# Altium schematic sheet 比较器.SchDoc
size A4
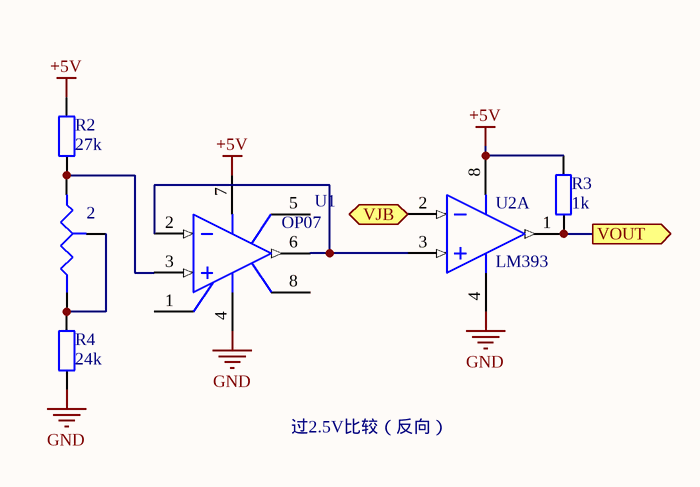
[diagram p0: 比较器.SchDoc]

## Parts
2  滑阻  [三脚滑阻]  (value not drawn)
R2  value 27k  [AXIAL-0.4]  (hidden comment: Res2)
R3  value 1k  [AXIAL-0.4]  (hidden comment: Res2)
R4  value 24k  [AXIAL-0.4]  (hidden comment: Res2)
U1  OP07  [N-8_A]
U2  LM393  [626-05]  (part A of 2)

## Ports
VJB (in), VOUT (out)

## Nets
+5V: R2.2 R3.2 U1.7(V+) U2.8(V+)
GND: R4.1 U1.4(V-) U2.4(GND)
VJB: U2.2(IN-) ; port VJB
VOUT: R3.1 U2.1(OUT) ; port VOUT
Net2_1: 2.1(A) R2.1 U1.3(IN+)
Net2_2: 2.2(TAP) 2.3(B) R4.2
NetU1_2: U1.2(IN-) U1.6(OUT) U2.3(IN+)

Not connected (* = marked no-connect by the designer): U1 1(NULL1) 5(NC) 8(NULL2)

## Notes on the sheet
- 过2.5V比较（反向）
- 标题
- 日期
- 红外数字模拟接收一体机
- 2015 5 29
- 作者
- 模电组
- 单位
- 电子技术协会

## Library data of the parts
R2-R4 = Res2: Resistor; Published: 8-Jun-2000; LatestRevisionDate: 17-Jul-2002; LatestRevisionNote: Re-released for DXP Platform.; PackageReference: AXIAL-0.4; Publisher: Altium Limited
U1 = ADOP07CN: Ultra-Low Offset Voltage Operational Amplifier; Note: Pin 5 is not connected.; Published: 8-Jun-2000; LatestRevisionDate: 04-Mar-2005; LatestRevisionNote: Stylized 3D Model Added.; DatasheetVersion: 1992; PackageReference: N-8_A; Publisher: Altium Limited; PackageDescription: DIP; 8 Leads; Row Spacing 7.62 mm; Pitch 2.54 mm; Code_JEDEC: MO-001-AN; ComponentLink1Description: Manufacturer Link; ComponentLink1URL: http://www.analog.com/
U2 = LM393AN: Dual Comparator; Published: 17-Jul-2002; LatestRevisionDate: 06-Jun-2005; LatestRevisionNote: Stylized 3D Model Added.; DatasheetVersion: 1988; PackageReference: 626-05; Publisher: Altium Limited; PackageDescription: DIP; 8 Leads; Row Spacing 7.62 mm; Pitch 2.54 mm; ComponentLink1Description: Manufacturer Link; ComponentLink1URL: http://www.onsemi.com/site/products/taxonomy/0,4438,133,00.html